# EAGLE design GB PCB - Tetris DX (EAGLE 6.2)
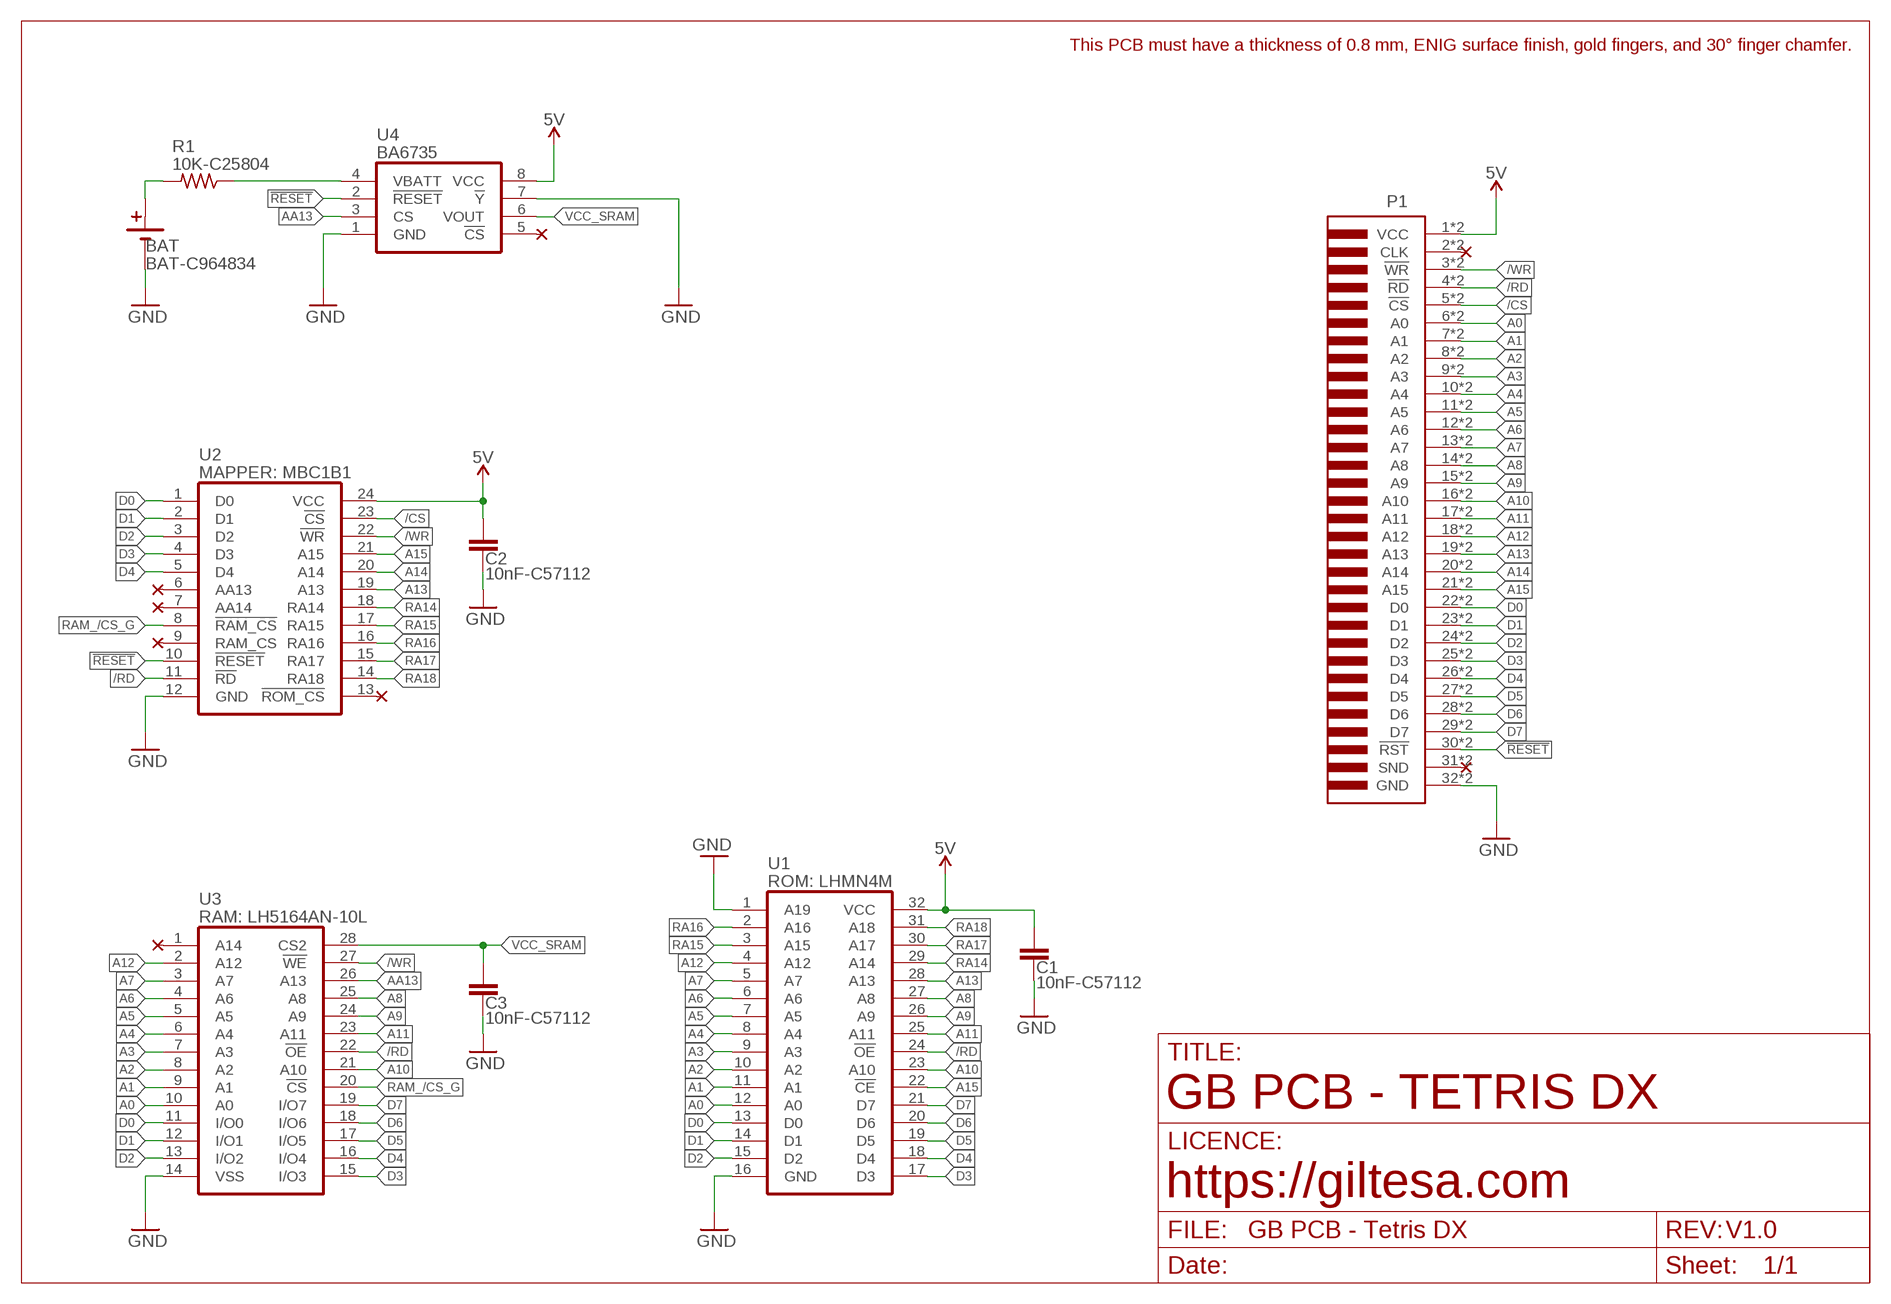
[diagram p0: schematic, sheet 1]

## Parts
BAT  BAT-C964834  CR2032MY-2032-12-R  [CR2032_MY-2032-12-R]
C1  10nF-C57112  C0603"  [C0603]
C2  10nF-C57112  C0603"  [C0603]
C3  10nF-C57112  C0603"  [C0603]
P1  GB_CARTRIDGE  [GB_CARTRIDGE]
R1  10K-C25804  R0603  [R0603]
U1  ROM: LHMN4M  LHMN4M  [LHMN4M]
U2  MAPPER: MBC1B1  MBC1B1  [MBC1B1]
U3  RAM: LH5164AN-10L  LH5164AN-10L  [LH5164AN-10L]
U4  BA6735  [BA6735]

## Nets
5V: C1.2 C2.1 P1.1"(VCC) P1.1(VCC) U1.32(VCC) U2.24(VCC) U4.8(VCC)
!RESET: P1.30"(!RST) P1.30(!RST) U2.10(!RESET) U4.2(!RESET)
/CS: P1.5"(!CS) P1.5(!CS) U2.23(!CS)
/RD: P1.4"(!RD) P1.4(!RD) U1.24(!OE) U2.11(!RD) U3.22(!OE)
/WR: P1.3"(!WR) P1.3(!WR) U2.22(!WR) U3.27(!WE)
A0: P1.6"(A0) P1.6(A0) U1.12(A0) U3.10(A0)
A1: P1.7"(A1) P1.7(A1) U1.11(A1) U3.9(A1)
A2: P1.8"(A2) P1.8(A2) U1.10(A2) U3.8(A2)
A3: P1.9"(A3) P1.9(A3) U1.9(A3) U3.7(A3)
A4: P1.10"(A4) P1.10(A4) U1.8(A4) U3.6(A4)
A5: P1.11"(A5) P1.11(A5) U1.7(A5) U3.5(A5)
A6: P1.12"(A6) P1.12(A6) U1.6(A6) U3.4(A6)
A7: P1.13"(A7) P1.13(A7) U1.5(A7) U3.3(A7)
A8: P1.14"(A8) P1.14(A8) U1.27(A8) U3.25(A8)
A9: P1.15"(A9) P1.15(A9) U1.26(A9) U3.24(A9)
A10: P1.16"(A10) P1.16(A10) U1.23(A10) U3.21(A10)
A11: P1.17"(A11) P1.17(A11) U1.25(A11) U3.23(A11)
A12: P1.18"(A12) P1.18(A12) U1.4(A12) U3.2(A12)
A13: P1.19"(A13) P1.19(A13) U1.28(A13) U2.19(A13)
A14: P1.20"(A14) P1.20(A14) U2.20(A14)
A15: P1.21"(A15) P1.21(A15) U1.22(!CE) U2.21(A15)
AA13: U3.26(A13) U4.3(CS)
D0: P1.22"(D0) P1.22(D0) U1.13(D0) U2.1(D0) U3.11(I/O0)
D1: P1.23"(D1) P1.23(D1) U1.14(D1) U2.2(D1) U3.12(I/O1)
D2: P1.24"(D2) P1.24(D2) U1.15(D2) U2.3(D2) U3.13(I/O2)
D3: P1.25"(D3) P1.25(D3) U1.17(D3) U2.4(D3) U3.15(I/O3)
D4: P1.26"(D4) P1.26(D4) U1.18(D4) U2.5(D4) U3.16(I/O4)
D5: P1.27"(D5) P1.27(D5) U1.19(D5) U3.17(I/O5)
D6: P1.28"(D6) P1.28(D6) U1.20(D6) U3.18(I/O6)
D7: P1.29"(D7) P1.29(D7) U1.21(D7) U3.19(I/O7)
GND: BAT.GND1(B-) BAT.GND2(B-) BAT.GND3(B-) C1.1 C2.2 C3.2 P1.32"(GND) P1.32(GND) U1.1(A19) U1.16(GND) U2.12(GND) U3.14(VSS) U4.1(GND) U4.7(!Y)
N$1: BAT.VCC1(B+) BAT.VCC2(B+) R1.2
N$16: R1.1 U4.4(VBATT)
RA14: U1.29(A14) U2.18(RA14)
RA15: U1.3(A15) U2.17(RA15)
RA16: U1.2(A16) U2.16(RA16)
RA17: U1.30(A17) U2.15(RA17)
RA18: U1.31(A18) U2.14(RA18)
RAM_/CS_G: U2.8(!RAM_CS) U3.20(!CS)
VCC_SRAM [VCC]: C3.1 U3.28(CS2) U4.6(VOUT)
Unconnected: P1.2"(CLK) P1.2(CLK) P1.31"(SND) P1.31(SND) U2.6(AA13) U2.7(AA14) U2.9(RAM_CS) U2.13(!ROM_CS) U3.1(A14) U4.5(!CS)

## Notes on the sheet
- This PCB must have a thickness of 0.8 mm, ENIG surface finish, gold fingers, and 30° finger chamfer.
- GB PCB - TETRIS DX
- https://giltesa.com
- V1.0

## Library data of the parts
BAT = ,giltesa:CR2032
C1-C3 = ,giltesa:C0603
P1 = ,giltesa:GB_CARTRIDGE
R1 = ,giltesa:R0603
U1 = ,giltesa:LHMN4M
U2 = ,giltesa:MBC1B1
U3 = ,giltesa:LH5164AN-10L
U4 = ,giltesa:BA6735

## Net classes
1 VCC: width 0.203 mm
2 GND: width 0.203 mm
3 power usb: width 0.508 mm, drill 0.406 mm, clearance 0.203 mm

## Board
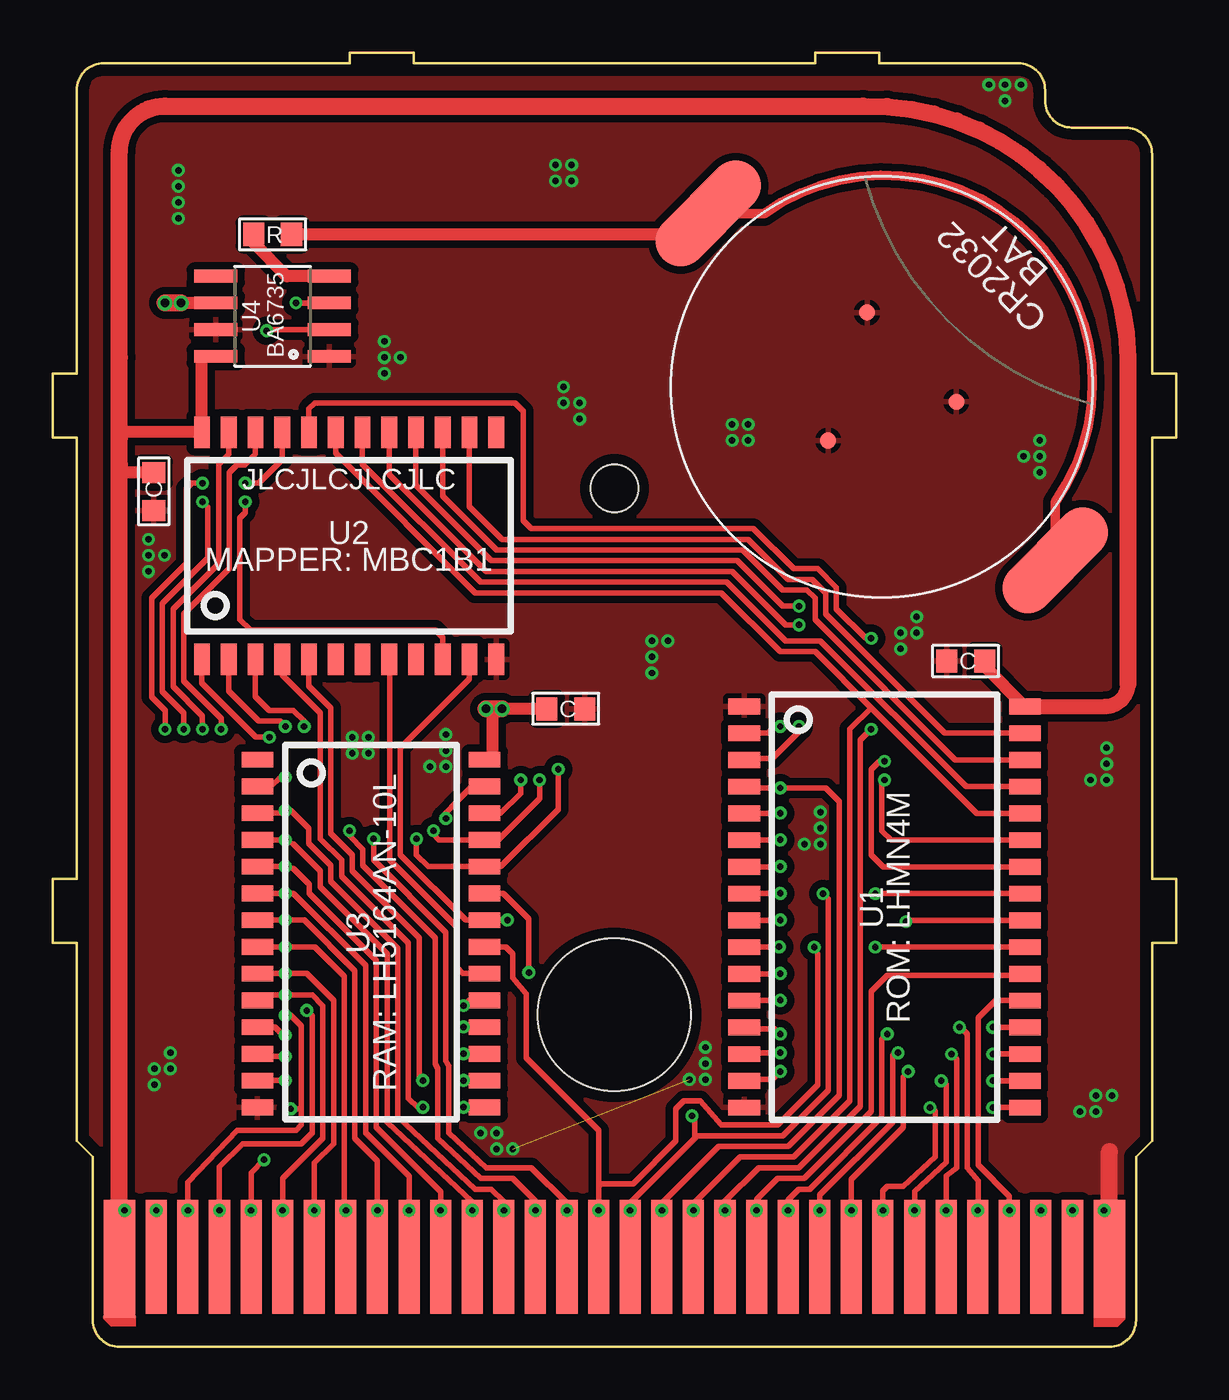
[diagram p1: board, top side]
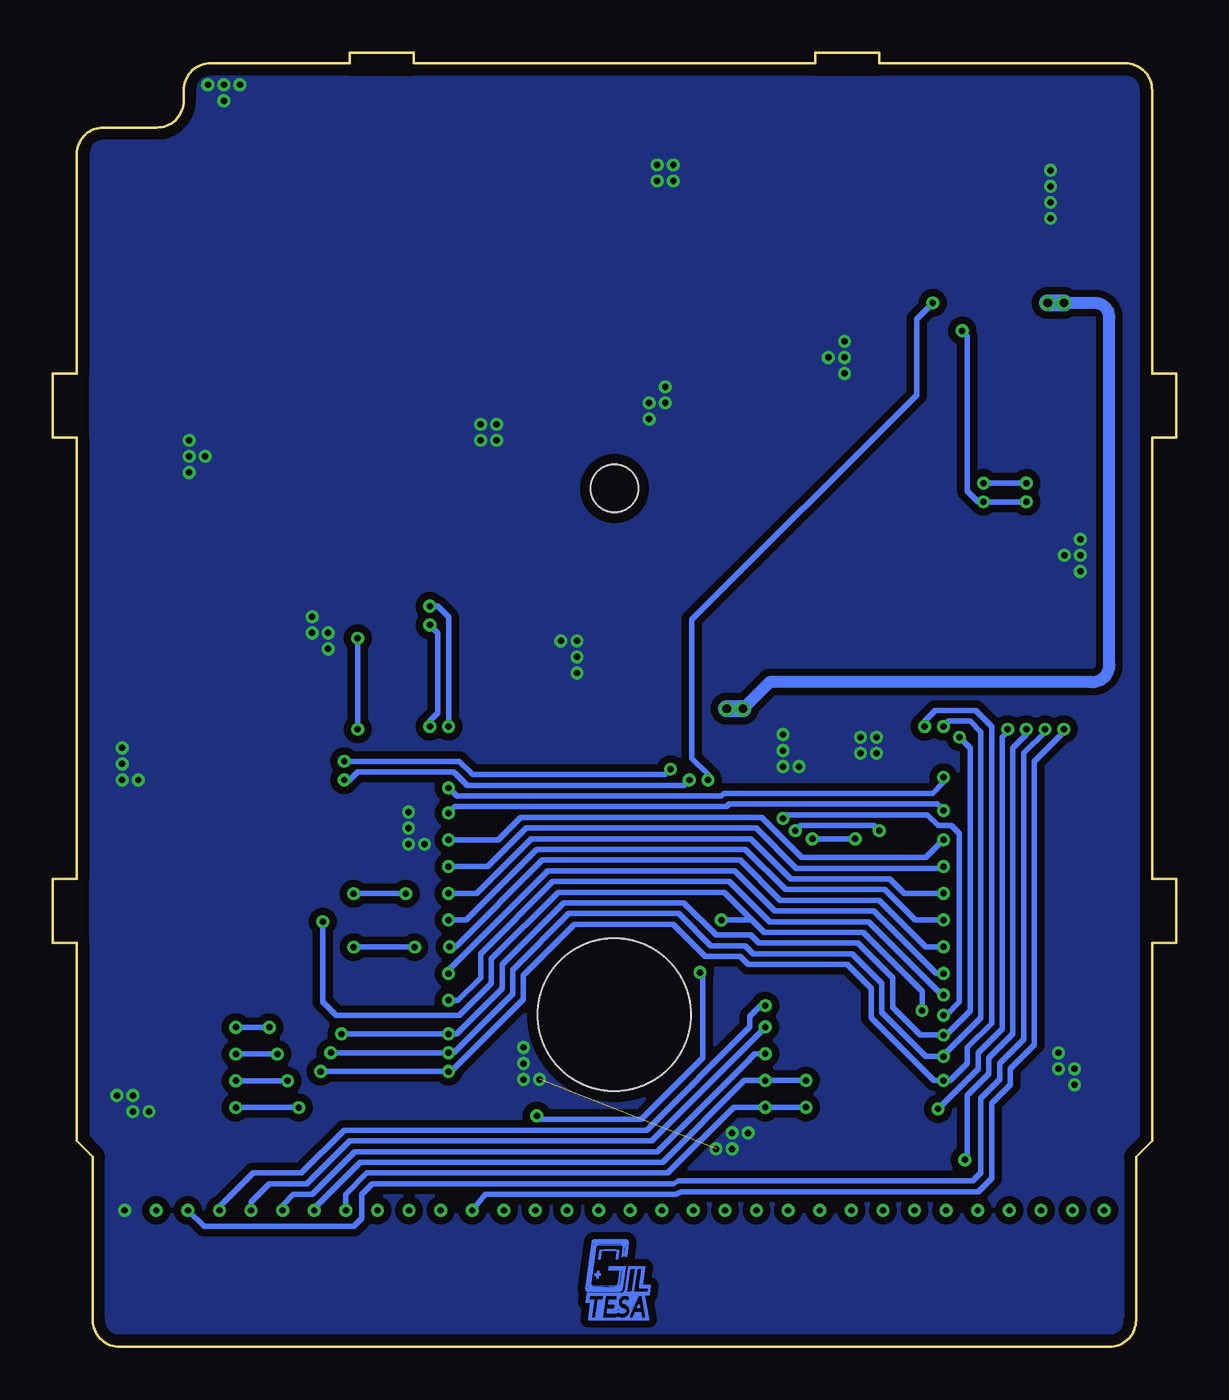
[diagram p2: board, bottom side, seen from below]

Size 53.34 x 61.47 mm. Coordinates in mm from the lower left corner, seen from the top.
Outline: 1.91,9.02 1.91,1.27 arc90 3.18,0 50.17,0 arc90 51.44,1.27 51.44,9.02 52.2,9.78 52.2,19.18 53.34,19.18 53.34,22.23 52.2,22.23 52.2,43.18 53.34,43.18 53.34,46.23 52.2,46.23 52.2,56.64 arc90 50.93,57.91 48.39,57.91 arc-90 47.12,59.18 47.12,59.69 arc90 45.85,60.96 39.24,60.96 39.24,61.47 36.2,61.47 36.2,60.96 17.15,60.96 17.15,61.47 14.1,61.47 14.1,60.96 2.41,60.96 arc90 1.14,59.69 1.14,46.23 0,46.23 0,43.18 1.14,43.18 1.14,22.23 0,22.23 0,19.18 1.14,19.18 1.14,9.78 1.91,9.02
Copper layers (1*16): Top 0.035mm / dielectric 1.6mm / Bottom 0.035mm
Design rules: minimum track width 6mil, minimum drill 12mil, track to track 6mil, track to pad 6mil, pad to pad 6mil, via to via 8mil, smd to smd 0mil, copper to edge 20mil, drill to drill 10mil, minimum pad ring 6mil, minimum via ring 6mil, stop-mask expansion 0mil, vias tented up to drill 100mil, thermal gap 10mil

### Footprints (pad centres in the part's own frame; a part is rotated, then mirrored left to right if it is on the bottom)
CR2032_MY-2032-12-R = smd 0.75 x 0.75: GND1 -3,2; GND2 3,2; GND3 0,-3.607 | smd 2.4 x 6.1: VCC1 -11.65,0; VCC2 11.65,0
C0603 = smd 1 x 1.1: 1 -0.901,0; 2 0.901,0
GB_CARTRIDGE = smd 1.5 x 5.6: 1 -23.5,-26.305; 32 23.5,-26.305 | drill 0.305: 1" -23.25,-23.995; 2" -21.75,-23.995; 3" -20.25,-23.995; 4" -18.75,-23.995; 5" -17.25,-23.995; 6" -15.75,-23.995; 7" -14.25,-23.995; 8" -12.75,-23.995; 9" -11.25,-23.995; 10" -9.75,-23.995; 11" -8.25,-23.995; 12" -6.75,-23.995; 13" -5.25,-23.995; 14" -3.75,-23.995; 15" -2.25,-23.995; 16" -0.75,-23.995; 17" 0.75,-23.995; 18" 2.25,-23.995; 19" 3.75,-23.995; 20" 5.25,-23.995; 21" 6.75,-23.995; 22" 8.25,-23.995; 23" 9.75,-23.995; 24" 11.25,-23.995; 25" 12.75,-23.995; 26" 14.25,-23.995; 27" 15.75,-23.995; 28" 17.25,-23.995; 29" 18.75,-23.995; 30" 20.25,-23.995; 31" 21.75,-23.995; 32" 23.25,-23.995 | smd 1 x 5.4: 2 -21.75,-26.205; 3 -20.25,-26.205; 4 -18.75,-26.205; 5 -17.25,-26.205; 6 -15.75,-26.205; 7 -14.25,-26.205; 8 -12.75,-26.205; 9 -11.25,-26.205; 10 -9.75,-26.205; 11 -8.25,-26.205; 12 -6.75,-26.205; 13 -5.25,-26.205; 14 -3.75,-26.205; 15 -2.25,-26.205; 16 -0.75,-26.205; 17 0.75,-26.205; 18 2.25,-26.205; 19 3.75,-26.205; 20 5.25,-26.205; 21 6.75,-26.205; 22 8.25,-26.205; 23 9.75,-26.205; 24 11.25,-26.205; 25 12.75,-26.205; 26 14.25,-26.205; 27 15.75,-26.205; 28 17.25,-26.205; 29 18.75,-26.205; 30 20.25,-26.205; 31 21.75,-26.205 | hole 7.25: 0,-14.705 | hole 2.25: 0,10.29
R0603 = smd 1 x 1.1: 1 -0.901,0; 2 0.901,0
LHMN4M = smd 0.75 x 1.5: 1 -9.538,-6.663; 2 -8.268,-6.663; 3 -6.998,-6.663; 4 -5.728,-6.663; 5 -4.458,-6.663; 6 -3.188,-6.663; 7 -1.918,-6.663; 8 -0.648,-6.663; 9 0.622,-6.663; 10 1.892,-6.663; 11 3.162,-6.663; 12 4.432,-6.663; 13 5.702,-6.663; 14 6.972,-6.663; 15 8.242,-6.663; 16 9.512,-6.663; 17 9.512,6.663; 18 8.242,6.663; 19 6.972,6.663; 20 5.702,6.663; 21 4.432,6.663; 22 3.162,6.663; 23 1.892,6.663; 24 0.622,6.663; 25 -0.648,6.663; 26 -1.918,6.663; 27 -3.188,6.663; 28 -4.458,6.663; 29 -5.728,6.663; 30 -6.998,6.663; 31 -8.268,6.663; 32 -9.538,6.663
MBC1B1 = smd 0.75 x 1.5: 1 -6.985,-5.394; 2 -5.715,-5.394; 3 -4.445,-5.394; 4 -3.175,-5.394; 5 -1.905,-5.394; 6 -0.635,-5.394; 7 0.635,-5.394; 8 1.905,-5.394; 9 3.175,-5.394; 10 4.445,-5.394; 11 5.715,-5.394; 12 6.985,-5.394; 13 6.985,5.394; 14 5.715,5.394; 15 4.445,5.394; 16 3.175,5.394; 17 1.905,5.394; 18 0.635,5.394; 19 -0.635,5.394; 20 -1.905,5.394; 21 -3.175,5.394; 22 -4.445,5.394; 23 -5.715,5.394; 24 -6.985,5.394
LH5164AN-10L = smd 0.75 x 1.5: 1 -8.204,-5.394; 2 -6.934,-5.394; 3 -5.664,-5.394; 4 -4.394,-5.394; 5 -3.124,-5.394; 6 -1.854,-5.394; 7 -0.584,-5.394; 8 0.686,-5.394; 9 1.956,-5.394; 10 3.226,-5.394; 11 4.496,-5.394; 12 5.766,-5.394; 13 7.036,-5.394; 14 8.306,-5.394; 15 8.306,5.394; 16 7.036,5.394; 17 5.766,5.394; 18 4.496,5.394; 19 3.226,5.394; 20 1.956,5.394; 21 0.686,5.394; 22 -0.584,5.394; 23 -1.854,5.394; 24 -3.124,5.394; 25 -4.394,5.394; 26 -5.664,5.394; 27 -6.934,5.394; 28 -8.204,5.394
BA6735 = smd 0.61 x 2.057: 1 -1.905,-2.692; 2 -0.635,-2.692; 3 0.635,-2.692; 4 1.905,-2.692; 5 1.905,2.692; 6 0.635,2.692; 7 -0.635,2.692; 8 -1.905,2.692

### Placement (x,y rotation side)
BAT  39.37,45.59 315 top
C1  43.35,32.58 0 top
C2  4.8,40.63 270 top
C3  24.36,30.3 0 top
P1  26.67,30.48 0 top
R1  10.44,52.83 0 top
U1  39.5,20.88 270 top
U2  14.07,38.05 0 top
U3  15.11,19.69 270 top
U4  10.44,48.95 90 top
U$12  [GILTESA_LOGO_COPPER]  28.07,1.27 0 bottom
U$13  [GILTESA.COM_7MM_STOP]  42.92,2.51 0 bottom

### Tracks (layer width: path | path; a pad name or v marks a point on that pad's centre or on a via)
5V
  Top 0.254: 3.17,1.38 P1.1
  Top 0.406: C1.2 44.2,32.58 44.2,32.89 44.25,32.89 44.25,32.33
  Top 0.559: 3.17,47.04 3.17,46.99 | 3.17,43.18 3.17,43.44 U2.24 7.09,46.97 7.16,47.04 U4.8 | C2.1 3.17,41.53 3.17,41.91 | P1.1 3.17,6.23 P1.1" | U1.32 44.25,32.33
  Top 0.711: U1.32 49.98,30.42 arc90 51.05,31.5
  Top 0.813: 51.05,31.5 51.05,46.99 arc90 38.48,58.93 5.33,58.93 arc90 3.17,56.76 3.17,46.99 3.17,43.18 3.17,41.91 P1.1
!RESET  (via drill 0.3)
  Top 0.254: P1.30 P1.30" | U2.10 18.52,33.68 18.16,34.04 9.4,34.04 8.89,34.54 8.89,39.37 9.14,39.62 v9.14,40.13 | U4.2 10.21,48.31 v10.16,48.26 | v7.11,40.13 7.37,39.88 7.37,37.47 5.21,35.31 5.21,31.12 6.22,30.1 v6.22,29.34
  Bottom 0.254: v7.11,40.13 v9.14,40.13 9.4,40.13 9.91,40.64 9.91,48.01 v10.16,48.26 | v6.22,29.34 6.22,29.21 7.24,28.19 7.24,14.61 8.38,13.46 8.38,12.7 9.27,11.81 9.27,8.25 9.65,7.87 23.62,7.87 23.88,7.75 38.16,7.75 38.67,7.24 38.67,6.1 39.05,5.71 46.15,5.71 P1.30"
/CS  (via drill 0.3)
  Top 0.254: P1.5 P1.5" 9.42,8.28 v10.03,8.89 | U2.23 8.36,42.39 7.87,41.91 7.87,37.21 5.72,35.05 5.72,31.37 7.11,29.97 v7.11,29.34
  Bottom 0.254: v7.11,29.34 7.11,29.08 7.75,28.45 7.75,14.86 8.89,13.72 8.89,12.95 9.91,11.94 9.91,9.02 v10.03,8.89
/RD  (via drill 0.3)
  Top 0.254: P1.4 P1.4" | P1.4" 7.92,6.78 | P1.4" 7.92,8.55 9.02,9.65 11.81,9.65 12.32,10.16 12.32,15.72 v12.07,15.98 | v21.59,20.27 U3.22 19.61,20.27 16.51,23.37 16.51,28.45 19.79,31.73 U2.11 | U1.24 40.58,20.26 v40.51,20.19
  Bottom 0.254: 20.14,20.27 19.56,19.69 14.86,19.69 12.07,16.89 v12.07,15.98 | 20.14,20.27 21.46,21.59 29.34,21.59 32.51,18.41 32.51,17.27 34.04,15.75 39.88,15.75 40.51,16.38 v40.51,20.19 | v21.59,20.27 20.14,20.27
/WR  (via drill 0.3)
  Top 0.254: P1.3 P1.3" 6.42,7.82 8.76,10.29 11.56,10.29 11.81,10.54 11.81,11.3 | U2.22 9.63,42.39 9.12,41.88 8.74,41.88 8.38,41.53 8.38,36.96 6.22,34.8 6.22,31.62 8,29.84 v8,29.34 | U3.27 19.89,26.62 19.18,25.91 18.67,25.35 v18.67,25.09 | v11.05,15.75 11.3,15.75 11.81,15.24 11.81,11.3 | v11.3,11.3 11.81,11.3
  Bottom 0.254: v11.05,15.75 10.92,15.75 10.29,16.38 10.29,24.38 10.67,24.77 11.3,24.77 11.81,25.27 18.49,25.27 v18.67,25.09 | v8,29.34 8,29.21 8.26,28.96 8.26,15.11 9.4,13.97 9.4,13.21 v11.3,11.3
A0  (via drill 0.3)
  Top 0.254: U1.12 34.53,16.45 v34.54,16.46 | P1.6 P1.6" 10.92,8 12.83,9.91 12.83,16.2 12.32,16.71 v11.05,16.71 9.97,16.71 U3.10 9.86,16.46 10.03,16.64
  Bottom 0.254: v34.54,16.46 34.53,16.45 34.1,16.45 33.02,17.53 33.02,18.67 29.59,22.1 21.21,22.1 19.3,20.19 14.61,20.19 11.13,16.71 v11.05,16.71
A1  (via drill 0.3)
  Top 0.254: U3.9 v11.05,17.73 12.07,17.73 13.34,16.46 13.34,9.65 12.42,8.74 P1.7" P1.7 | U1.11 34.53,17.72 v34.54,17.73
  Bottom 0.254: v34.54,17.73 34.54,17.91 29.85,22.61 20.96,22.61 19.05,20.7 14.35,20.7 11.38,17.73 v11.05,17.73
A2  (via drill 0.3)
  Top 0.254: U3.8 v11.05,19 12.45,19 13.84,17.6 13.84,6.66 P1.8" P1.8 | U1.10 34.53,18.99 v34.49,19
  Bottom 0.254: v34.49,19 34.21,19 30.1,23.11 20.7,23.11 18.8,21.21 14.1,21.21 11.89,19 v11.05,19
A3  (via drill 0.3)
  Top 0.254: U3.7 v11.05,20.27 11.94,20.27 14.35,17.86 14.35,9.91 15.42,8.84 P1.9" P1.9 | U1.9 34.53,20.26 v34.54,20.27
  Bottom 0.254: v34.54,20.27 33.71,20.27 30.35,23.62 20.45,23.62 18.54,21.72 13.84,21.72 12.4,20.27 v11.05,20.27
A4  (via drill 0.3)
  Top 0.254: U3.6 v11.05,21.54 11.43,21.54 14.86,18.11 14.86,10.16 16.92,8.1 P1.10" P1.10 | U1.8 34.53,21.53 v34.54,21.54
  Bottom 0.254: v34.54,21.54 33.2,21.54 30.61,24.13 20.7,24.13 20.2,24.13 18.29,22.23 13.59,22.23 12.9,21.54 v11.05,21.54
A5  (via drill 0.3)
  Top 0.254: U3.5 v11.05,22.81 11.43,22.73 12.19,21.97 12.19,21.54 15.37,18.36 15.37,10.41 18.42,7.36 P1.11" P1.11 | U1.7 34.53,22.8 v34.54,22.81
  Bottom 0.254: v34.54,22.81 32.69,22.81 30.86,24.64 19.94,24.64 18.03,22.73 11.13,22.73 v11.05,22.81
A6  (via drill 0.3)
  Top 0.254: U3.4 v11.05,24.08 11.43,23.88 12.7,22.61 12.7,21.84 15.88,18.67 15.88,10.67 19.92,6.88 P1.12" P1.12 | U1.6 34.53,24.07 v34.54,24.08
  Bottom 0.254: v34.54,24.08 32.18,24.08 31.12,25.15 19.69,25.15 17.78,23.24 11.89,23.24 v11.05,24.08
A7  (via drill 0.3)
  Top 0.254: U1.5 34.66,25.34 v34.54,25.35 | P1.13 P1.13" 21.42,6.9 20.83,7.49 20.07,7.49 16.38,10.92 16.38,18.92 13.21,22.1 13.21,22.86 12.17,23.9 12.17,24.61 11.3,25.48 v11.05,25.48 10.92,25.35 U3.3
  Bottom 0.254: v34.54,25.35 34.24,25.65 21.34,25.65 21.21,25.78 11.35,25.78 v11.05,25.48
A8  (via drill 0.3)
  Top 0.254: P1.14 P1.14" 22.92,6.93 21.84,8 20.32,8 18.29,9.91 18.29,13.21 18.16,13.46 18.16,19.43 14.73,22.86 14.73,23.62 14.1,24.26 v14.1,24.51 | v23.11,26.92 23.11,26.04 21.16,24.08 U3.25 18.34,24.08 18.09,24.33 v18.09,24.51 | v39.5,26.92 39.37,26.8 39.37,24.51 39.81,24.07 U1.27
  Bottom 0.254: v23.11,26.92 23.37,26.67 33.66,26.67 34.29,27.3 38.86,27.3 39.24,26.92 v39.5,26.92 | v14.1,24.51 14.35,24.77 17.83,24.77 v18.09,24.51
A9  (via drill 0.3)
  Top 0.254: P1.15 P1.15" 24.42,6.82 22.73,8.51 20.57,8.51 18.8,10.16 18.8,13.34 18.67,13.59 18.67,19.69 15.24,23.11 v15.24,24.13 | v24,27.43 24,25.53 21.29,22.81 U3.24 17.83,22.81 17.27,23.37 v17.27,24.13 | v39.5,27.81 39.24,27.81 38.86,27.43 38.86,23.37 39.43,22.8 U1.26
  Bottom 0.254: v39.5,27.81 34.04,27.81 33.4,27.18 24.26,27.18 v24,27.43 | v15.24,24.13 v17.27,24.13
A10  (via drill 0.3)
  Top 0.254: P1.16 P1.16" 25.92,7.62 | U1.23 v39.05,18.99 | v36.16,18.99 36.32,18.67 36.32,12.45 34.42,10.54 31.75,10.54 30.73,11.68 29.97,11.68 29.59,11.3 29.59,9.78 27.56,7.75 26.05,7.75 25.92,7.62 | U3.21 21.51,19 21.84,18.67 21.84,17.53 22.48,16.76 22.48,13.72 25.92,10.28 25.92,7.62
  Bottom 0.254: v39.05,18.99 v36.16,18.99
A11  (via drill 0.3)
  Top 0.254: P1.17 P1.17" 27.42,6.85 30.29,9.71 30.48,9.91 | U1.25 v39.05,21.53 | v36.58,21.53 36.83,21.27 36.83,12.19 34.67,10.03 30.61,10.03 30.48,9.91 | v22.61,17.78 22.61,20.32 21.39,21.54 U3.23 | 30.48,9.91 30.48,10.85 v30.35,10.97
  Bottom 0.254: v39.05,21.53 v36.58,21.53 | v22.61,17.78 22.61,17.65 22.48,17.53 22.48,13.72 25.4,10.8 30.23,10.8 v30.35,10.97
A12  (via drill 0.3)
  Top 0.254: P1.18 P1.18" 28.92,6.82 31.62,9.53 34.93,9.53 37.34,11.94 37.34,25.91 36.7,26.54 v34.54,26.54 33.02,26.54 32.9,26.67 U1.4 | U3.2 10.36,26.62 10.8,27.05 v11.05,27.05
  Bottom 0.254: v34.54,26.54 34.16,26.16 21.59,26.16 21.46,26.29 11.56,26.29 11.05,26.8 v11.05,27.05
A13
  Top 0.254: P1.19 P1.19" 30.42,6.8 32.64,9.02 35.18,9.02 37.85,11.68 37.85,29.34 38.86,30.35 | 38.86,30.35 36.2,33.02 34.54,33.02 31.75,35.81 20.07,35.81 13.44,42.44 U2.19 | 38.86,30.35 43.88,25.34 U1.28
A14  (via drill 0.3)
  Top 0.254: P1.20 P1.20" 31.92,6.9 33.53,8.51 35.43,8.51 38.35,11.43 38.35,28.83 v38.86,29.34 | U2.20 12.17,44.55 12.45,44.83 21.97,44.83 22.35,44.45 22.35,39.24 22.73,38.86 33.27,38.86 35.18,36.96 36.32,36.96 37.21,36.07 37.21,35.05 38.61,33.66 v38.86,33.66
  Bottom 0.254: v38.86,29.34 v38.86,33.66
A15  (via drill 0.3)
  Top 0.254: P1.21 P1.21" | U1.22 46.1,17.65 39.62,17.65 38.86,16.89 38.86,11.18 35.69,8 34.42,8 33.42,7 P1.21" | P1.21" 33.42,6.75 | U2.21 10.9,42.14 9.78,41.02 v9.14,41.02 | v7.11,41.02 6.6,41.02 6.35,40.77 6.35,37.21 4.7,35.56 4.7,30.86 5.33,30.23 v5.33,29.34
  Bottom 0.254: v9.14,41.02 v7.11,41.02 | v5.33,29.34 5.33,29.21 6.73,27.81 6.73,14.35 7.87,13.21 7.87,12.45 8.76,11.56 8.76,8 9.4,7.37 23.5,7.37 23.75,7.24 32.79,7.24 P1.21"
AA13  (via drill 0.3)
  Top 0.254: U4.3 v11.56,49.58 | U3.26 21.29,25.35 22.23,26.29 v22.23,26.92
  Bottom 0.254: v11.56,49.58 12.32,48.82 12.32,45.21 22.99,34.54 22.99,27.94 22.23,27.18 v22.23,26.92
D0  (via drill 0.3)
  Top 0.254: P1.22 P1.22" 34.92,6.98 35.43,7.49 35.94,7.49 39.37,10.92 39.37,14.61 v39.62,14.86 | 32.9,15.11 33.27,15.11 | 33.27,15.11 34.29,15.11 v34.54,14.86 | U1.13 33.21,15.18 33.27,15.11 | U3.11 10.54,15.19 10.92,14.81 v11.05,14.81 | U2.1 7.09,31.52 9.65,28.96 v10.29,28.96
  Bottom 0.254: v39.62,14.86 v34.54,14.86 34.16,14.86 32,17.02 32,18.16 29.08,21.08 23.37,21.08 21.84,19.56 20.19,19.56 19.81,19.18 15.11,19.18 13.46,17.53 13.46,16.13 12.14,14.81 v11.05,14.81 10.92,14.81 9.78,15.95 9.78,28.45 v10.29,28.96
D1  (via drill 0.3)
  Top 0.254: P1.23 P1.23" 36.42,7.21 39.88,10.67 39.88,13.84 40.01,13.97 v40.13,13.97 | v34.54,13.97 32.9,13.97 U1.14 | U3.12 9.85,13.79 v11.05,13.79 | U2.2 8.36,31.14 9.78,29.72 10.8,29.72 v11.05,29.46
  Bottom 0.254: v40.13,13.97 v34.54,13.97 34.29,13.97 31.5,16.76 31.5,17.91 28.83,20.57 23.62,20.57 22.1,19.05 20.45,19.05 20.07,18.67 15.37,18.67 13.97,17.27 13.97,15.88 11.89,13.79 v11.05,13.79 11.1,13.79 9.27,15.62 9.27,29.21 9.78,29.72 10.8,29.72 v11.05,29.46
D2  (via drill 0.3)
  Top 0.254: P1.24 P1.24" 37.92,7.95 40.39,10.41 40.39,12.83 v40.62,13.08 | v34.54,13.08 34.16,12.7 32.9,12.7 U1.15 | U3.13 v11.05,12.65 | U2.3 9.63,30.89 10.29,30.23 11.43,30.23 11.94,29.72 v11.94,29.46
  Bottom 0.254: v40.62,13.08 v34.54,13.08 34.42,13.08 30.99,16.51 30.99,17.65 28.58,20.07 23.88,20.07 22.35,18.54 20.7,18.54 20.32,18.16 15.62,18.16 14.48,17.02 14.48,15.62 11.51,12.65 v11.05,12.65 10.72,12.65 9.91,13.46 9.91,14.22 8.76,15.37 8.76,29.46 9.53,30.23 11.43,30.23 11.94,29.72 v11.94,29.46
D3  (via drill 0.3)
  Top 0.254: U1.17 v44.64,11.37 | v41.66,11.37 41.72,11.37 41.91,11.18 41.91,9.02 40.39,7.62 39.62,7.62 39.42,7.42 P1.25" P1.25 | U2.4 10.9,31.9 12.7,30.1 12.7,24.13 13.72,23.11 13.72,22.35 16.89,19.18 16.89,11.81 17.32,11.38 v17.58,11.38 | U3.15 v19.51,11.38
  Bottom 0.254: v44.64,11.37 v41.66,11.37 | P1.25" 39.42,7.25 38.42,8.25 24.13,8.25 21.01,11.38 v19.51,11.38 v17.58,11.38
D4  (via drill 0.3)
  Top 0.254: P1.26 P1.26" 40.92,7.39 42.42,8.76 42.42,12.47 42.23,12.64 v42.19,12.64 | U1.18 v44.64,12.64 | U2.5 12.17,31.39 13.21,30.35 13.21,24.38 14.22,23.37 14.22,22.61 17.4,19.43 17.4,12.83 v17.58,12.65 | U3.16 v19.51,12.65
  Bottom 0.254: v44.64,12.64 v42.19,12.64 | v17.58,12.65 v19.51,12.65 20.5,12.65 24.38,8.76 38.73,8.76 40.92,6.58 P1.26"
D5  (via drill 0.3)
  Top 0.254: P1.27 P1.27" 42.42,8.13 42.93,8.51 42.93,13.65 v42.67,13.91 | U1.19 v44.64,13.91 | U3.17 v19.51,13.92
  Bottom 0.254: v44.64,13.91 v42.67,13.91 | v19.51,13.92 20,13.92 20.24,13.67 20.24,13.66 24.64,9.27 38.99,9.27 41.02,7.24 41.91,7.24 42.42,6.73 P1.27"
D6  (via drill 0.3)
  Top 0.254: P1.28 P1.28" 43.94,6.51 43.94,7.87 43.43,8.51 43.43,14.86 43.12,15.18 v43.05,15.18 | U1.20 v44.64,15.18 | U3.18 v19.51,15.19
  Bottom 0.254: v44.64,15.18 v43.05,15.18 | v19.51,15.19 19.48,15.19 24.89,9.78 39.24,9.78 41.28,7.75 43.05,7.75 43.92,6.88 P1.28"
D7  (via drill 0.3)
  Top 0.254: P1.29 P1.29" 45.42,7.16 43.94,8.64 43.94,15.62 44.77,16.45 U1.21 | U3.19 19.76,16.46 v19.51,16.2
  Bottom 0.254: v19.51,16.2 19.74,16.2 20.24,15.7 20.24,15.19 25.15,10.29 39.5,10.29 41.53,8.25 43.81,8.25 45.42,6.65 P1.29"
GND  (via drill 0.3)  (1 unrouted)
  Top 0.254: 50.17,1.38 P1.32
  Top 0.813: P1.32 50.17,9.28
  other vias: 4.83,12.45 4.83,13.21 48.77,11.18 49.53,11.94 28.45,32.77 28.45,32 41.02,33.91 40.26,33.91 25.02,44.07 24.26,44.83 24.64,56.13 4.55,38.35 4.55,37.59 4.55,36.83 5.31,37.59 24.26,45.59 25.02,44.83 23.88,56.13 23.88,55.37 24.64,55.37 28.45,33.53 29.21,33.53 41.02,34.67 40.26,33.15 49.53,11.18 50.29,11.94 49.28,26.92 50.04,26.92 50.04,27.69 50.04,28.45 5.59,13.21 5.59,13.97 5.97,55.88 5.97,55.12 5.97,54.36 5.97,53.59 45.21,59.18 45.21,59.94 44.45,59.94 45.97,59.94 15.75,46.23 15.75,46.99 15.75,47.75 16.51,46.99 18.67,29.08 18.67,28.32 18.67,27.56 17.91,27.56 14.22,28.96 14.22,28.19 14.99,28.19 14.99,28.96 30.99,14.22 30.99,13.46 30.99,12.7 30.23,12.7 46.1,42.29 46.86,42.29 46.86,41.53 46.86,43.05 32.26,43.81 32.26,43.05 33.02,43.05 33.02,43.81 20.32,10.16 21.08,10.16 21.08,9.4 21.84,9.4 36.45,25.4 36.45,24.64 36.45,23.88 35.69,23.88
  pour Top (isolate 0.356): 1.83,60.27 51.51,60.27 51.51,6.1 1.83,6.1
  pour Bottom (isolate 0.356): 1.83,60.27 51.51,60.27 51.51,-2 1.83,-2
N$1
  Top 0.457: 29.62,52.83 BAT.VCC1 33.78,53.83 arc-160 47.61,40.13 BAT.VCC2
  Top 0.559: 29.62,52.83 R1.2
N$16
  Top 0.559: U4.4 11.13,50.85 9.54,52.44 R1.1
RA14
  Top 0.254: U1.29 43.37,26.61 36.45,33.53 34.8,33.53 32,36.32 20.32,36.32 14.71,41.94 U2.18
RA15  (via drill 0.3)
  Top 0.254: U1.3 32.9,27.94 34.16,27.94 35.43,29.21 v35.43,29.46 | U2.17 15.98,41.43 20.57,36.83 32.26,36.83 34.8,34.29 v35.43,34.29
  Bottom 0.254: v35.43,34.29 35.05,33.91 35.05,30.1 35.43,29.72 v35.43,29.46
RA16  (via drill 0.3)
  Top 0.254: 32.9,29.21 U1.2 33.97,29.15 34.29,29.46 v34.54,29.46 | U2.16 17.25,40.92 20.83,37.34 32.51,37.34 34.67,35.18 v35.43,35.18
  Bottom 0.254: v35.43,35.18 35.05,35.18 34.54,34.67 v34.54,29.46
RA17
  Top 0.254: U1.30 42.86,27.88 36.2,34.54 36.2,35.56 35.81,35.94 34.67,35.94 32.77,37.85 21.08,37.85 18.52,40.41 U2.15
RA18
  Top 0.254: U1.31 42.35,29.15 36.7,34.8 36.7,35.81 36.07,36.45 34.93,36.45 33.02,38.35 21.34,38.35 19.79,39.9 U2.14
RAM_/CS_G
  Top 0.254: 20.43,17.65 U3.20 19.48,17.73 19.18,18.03 19.18,19.94 16,23.11 16,32.63 U2.8
VCC_SRAM  (via drill 0.41)
  Top 0.559: C3.1 v21.34,30.3 20.63,30.3 | U4.6 v6.1,49.58 | U3.28 20.9,27.89 20.9,30.3 v20.57,30.3
  Top 0.813: v21.34,30.3 v20.57,30.3 | v6.1,49.58 v5.33,49.58
  Bottom 0.559: v5.33,49.58 3.86,49.58 arc90 3.18,48.89 3.18,32.38 arc90 3.99,31.57 19.3,31.57 v20.57,30.3
  Bottom 0.813: v5.33,49.58 v6.1,49.58 | v20.57,30.3 v21.34,30.3

### Text on the board
tPlace: R | BAT | CR2032 | JLCJLCJLCJLC | C | C | C
bStop: 2024/04